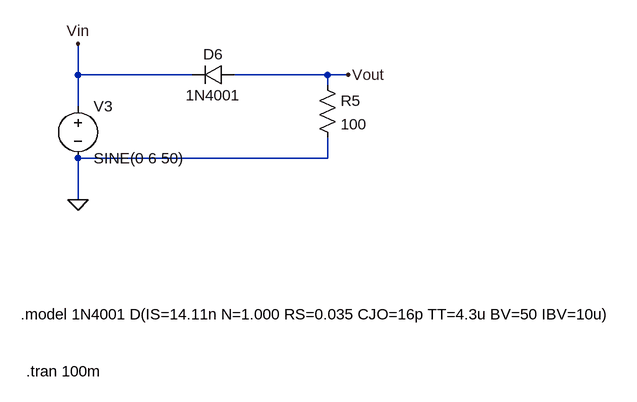
[diagram p0: schematic Draft2.asc]
Draft2.asc, the LTspice schematic file:
Version 4.1
SHEET 1 1400 936
WIRE -96 464 -96 416
WIRE 80 464 -96 464
WIRE 288 464 144 464
WIRE 320 464 288 464
WIRE 288 480 288 464
WIRE -96 512 -96 464
WIRE 288 592 288 560
WIRE 288 592 -96 592
WIRE -96 656 -96 592
FLAG 320 464 Vout
FLAG -96 656 0
FLAG -96 416 Vin
SYMBOL voltage -96 496 R0
WINDOW 123 24 124 Left 2
WINDOW 39 0 0 Left 0
SYMATTR InstName V3
SYMATTR Value SINE(0 6 50)
SYMBOL diode 144 448 R90
WINDOW 0 0 32 VBottom 2
WINDOW 3 32 32 VTop 2
SYMATTR InstName D6
SYMATTR Value 1N4001
SYMBOL res 272 464 R0
SYMATTR InstName R5
SYMATTR Value 100
TEXT -184 832 Left 2 !.model 1N4001 D(IS=14.11n N=1.000 RS=0.035 CJO=16p TT=4.3u BV=50 IBV=10u)
TEXT -176 920 Left 2 !.tran 100m

The netlist it stands for:
* Draft2.asc
V3 Vin 0 SINE(0 6 50)
D6 Vout Vin 1N4001
R5 Vout 0 100
.model D D
.lib standard.dio
.model 1N4001 D(IS=14.11n N=1.000 RS=0.035 CJO=16p TT=4.3u BV=50 IBV=10u)
.tran 100m
.backanno
.end

* Results of the author's LTspice run, read from the files saved beside the schematic
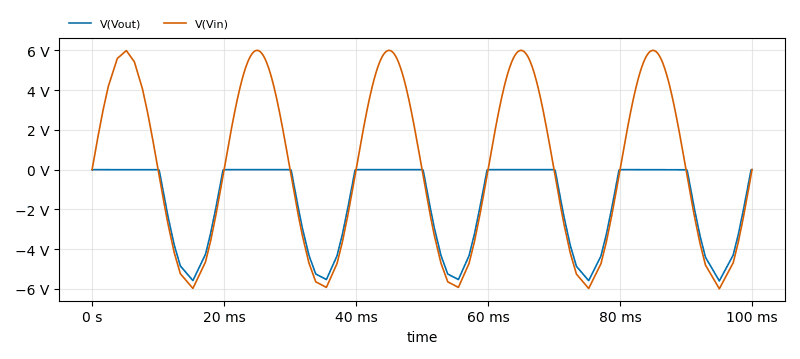
[diagram p1: Transient Analysis of Draft2.asc, plotted from the saved traces]
* Transient Analysis, 1 run:
*   V(Vout): min -5.598 V, max 408.7 µV, average -1.692 V, rms 2.71 V, last -400.3 µV
*   V(Vin): min -5.993 V, max 6 V, average 29.65 mV, rms 4.207 V, last 0 V